# Altium project Cell_121.PrjPcb
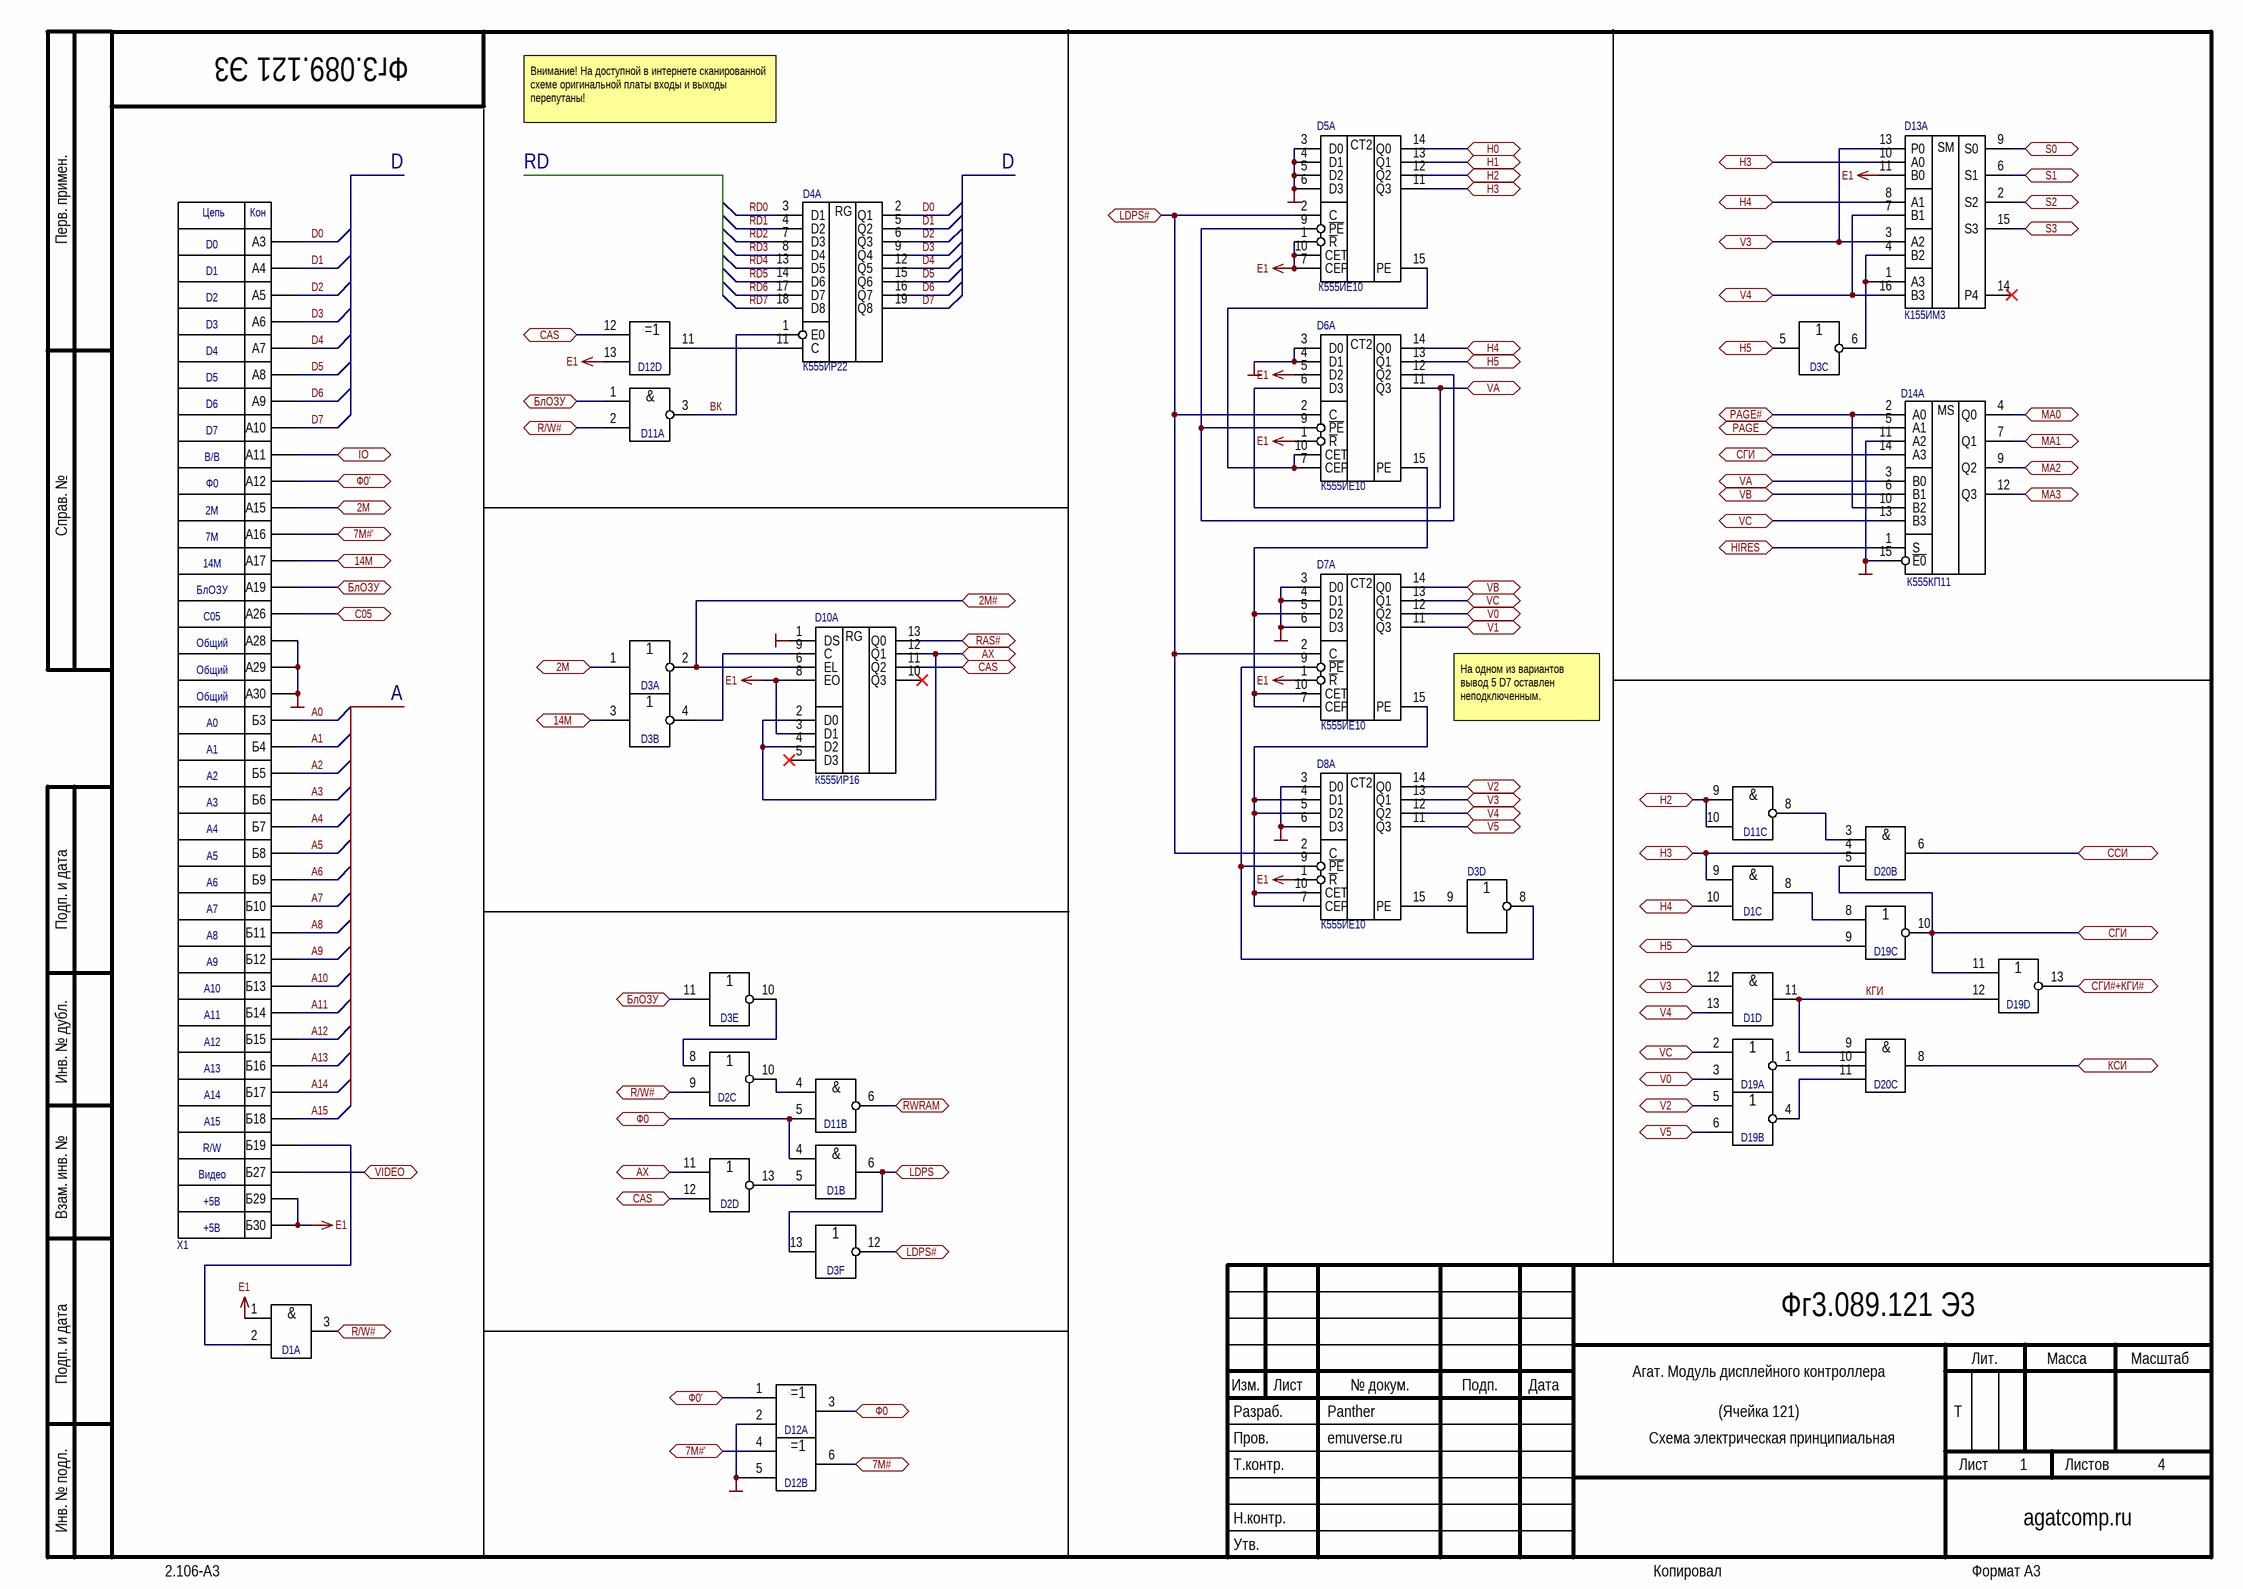
[diagram p0: Cell_121_sheet_1.SchDoc]
4 sheets, 104 parts. Net scope: global (net labels, ports and power ports of the same name join across sheets).
Board file: Cell_121.PcbDoc
Sheets:
  Cell_121_sheet_1.SchDoc
  Cell_121_sheet_2.SchDoc
  Cell_121_sheet_3.SchDoc
  Cell_121_sheet_4.SchDoc

## Sheet Cell_121_sheet_1.SchDoc: Агат. Модуль дисплейного контроллера
size 420 x 297 mm; ApprovedBy: v0.4; CheckedBy: emuverse.ru; Author: Panther; CompanyName: agatcomp.ru; DocumentNumber: Фг3.089.121 Э3; Revision: v0.4; SheetNumber: 1; SheetTotal: 4; DocumentType: Схема электрическая принципиальная; Title2str: (Ячейка 121); Letter1Column: T

### Parts
D1  К555ЛИ1  [201.14]  (value not drawn)  (parts A,B,C,D of 5)
D2  К555ЛЕ1  [201.14]  (value not drawn)  (parts C,D of 5)
D3  К555ЛН1  [201.14]  (value not drawn)  (parts A,B,C,D,E,F of 7)
D4  К555ИР22  [201.20]  (part A of 2)
D5  К555ИЕ10  [201.16]  (part A of 2)
D6  К555ИЕ10  [201.16]  (part A of 2)
D7  К555ИЕ10  [201.16]  (part A of 2)
D8  К555ИЕ10  [201.16]  (part A of 2)
D10  К555ИР16  [201.14]  (part A of 2)
D11  К555ЛА3  [201.14]  (value not drawn)  (parts A,B,C of 5)
D12  К555ЛП5  [201.14]  (value not drawn)  (parts A,B,D of 5)
D13  К155ИМ3  [201.16]  (part A of 2)
D14  К555КП11  [201.16]  (part A of 2)
D19  К555ЛЕ1  [201.14]  (value not drawn)  (parts A,B,C,D of 5)
D20  К555ЛИ3  [201.14]  (value not drawn)  (parts B,C of 4)
X1  Agat-Ext  [AGAT_EXT]  (value not drawn)  (no BOM)

### Ports
2M (bidir, see Cell_121_sheet_1[1B]), 2M# (bidir, see Cell_121_sheet_3[2D]), 7M# (bidir, see Cell_121_sheet_3[1B], Cell_121_sheet_3[1C], Cell_121_sheet_3[2B], Cell_121_sheet_3[3B]), 7M#' (bidir, see Cell_121_sheet_1[1B]), 7M#' (bidir, see Cell_121_sheet_1[2D]), 14M (bidir, see Cell_121_sheet_1[1B]), AX (bidir, see Cell_121_sheet_1[2B], Cell_121_sheet_2[2C]), AX (bidir, see Cell_121_sheet_1[2C], Cell_121_sheet_2[2C]), C05 (bidir, see Cell_121_sheet_3[2D]), CAS (bidir, see Cell_121_sheet_1[1A], Cell_121_sheet_1[2B], Cell_121_sheet_2[3B], Cell_121_sheet_2[3C], Cell_121_sheet_2[3D]), CAS (bidir, see Cell_121_sheet_1[1A], Cell_121_sheet_1[2D], Cell_121_sheet_2[3B], Cell_121_sheet_2[3C], Cell_121_sheet_2[3D]), CAS (bidir, see Cell_121_sheet_1[2B], Cell_121_sheet_1[2D], Cell_121_sheet_2[3B], Cell_121_sheet_2[3C], Cell_121_sheet_2[3D]), H0 (bidir, see Cell_121_sheet_2[2B]), H1 (bidir, see Cell_121_sheet_2[2C]), H2 (bidir, see Cell_121_sheet_1[3A], Cell_121_sheet_2[2B]), H2 (bidir, see Cell_121_sheet_1[3C], Cell_121_sheet_2[2B]), H3 (bidir, see Cell_121_sheet_1[3A], Cell_121_sheet_1[3C]), H3 (bidir, see Cell_121_sheet_1[3A], Cell_121_sheet_1[4A]), H3 (bidir, see Cell_121_sheet_1[3C], Cell_121_sheet_1[4A]), H4 (bidir, see Cell_121_sheet_1[3A], Cell_121_sheet_1[3C]), H4 (bidir, see Cell_121_sheet_1[3A], Cell_121_sheet_1[4A]), H4 (bidir, see Cell_121_sheet_1[3C], Cell_121_sheet_1[4A]), H5 (bidir, see Cell_121_sheet_1[3A], Cell_121_sheet_1[3C]), H5 (bidir, see Cell_121_sheet_1[3A], Cell_121_sheet_1[4A]), H5 (bidir, see Cell_121_sheet_1[3C], Cell_121_sheet_1[4A]), HIRES (bidir, see Cell_121_sheet_3[4D]), IO (bidir, see Cell_121_sheet_2[1D]), LDPS (bidir, see Cell_121_sheet_3[1B], Cell_121_sheet_3[2B], Cell_121_sheet_3[3B]), LDPS# (bidir, see Cell_121_sheet_1[2A]), LDPS# (bidir, see Cell_121_sheet_1[2D]), MA0 (bidir, see Cell_121_sheet_2[2A]), MA1 (bidir, see Cell_121_sheet_2[2B]), MA2 (bidir, see Cell_121_sheet_2[2C]), MA3 (bidir, see Cell_121_sheet_2[2C]), PAGE (bidir, see Cell_121_sheet_3[4C]), PAGE# (bidir, see Cell_121_sheet_3[4C]), R/W# (bidir, see Cell_121_sheet_1[1B], Cell_121_sheet_1[1D], Cell_121_sheet_2[1D]), R/W# (bidir, see Cell_121_sheet_1[1B], Cell_121_sheet_1[2C], Cell_121_sheet_2[1D]), R/W# (bidir, see Cell_121_sheet_1[1D], Cell_121_sheet_1[2C], Cell_121_sheet_2[1D]), RAS# (bidir, see Cell_121_sheet_2[3B], Cell_121_sheet_2[3C], Cell_121_sheet_3[1A], Cell_121_sheet_3[1B]), RWRAM (bidir, see Cell_121_sheet_2[3B], Cell_121_sheet_2[3C], Cell_121_sheet_2[3D]), S0 (bidir, see Cell_121_sheet_2[2C]), S1 (bidir, see Cell_121_sheet_2[2A]), S2 (bidir, see Cell_121_sheet_2[2B]), S3 (bidir, see Cell_121_sheet_2[2C]), V0 (bidir, see Cell_121_sheet_1[3B], Cell_121_sheet_2[2A]), V0 (bidir, see Cell_121_sheet_1[3C], Cell_121_sheet_2[2A]), V1 (bidir, see Cell_121_sheet_2[2B]), V2 (bidir, see Cell_121_sheet_1[3B], Cell_121_sheet_2[2C], Cell_121_sheet_3[4C]), V2 (bidir, see Cell_121_sheet_1[3C], Cell_121_sheet_2[2C], Cell_121_sheet_3[4C]), V3 (bidir, see Cell_121_sheet_1[3C]), V3 (bidir, see Cell_121_sheet_1[3C], Cell_121_sheet_1[4A]), V4 (bidir, see Cell_121_sheet_1[3C], Cell_121_sheet_1[4A], Cell_121_sheet_3[4C]), V4 (bidir, see Cell_121_sheet_1[3C], Cell_121_sheet_3[4C]), V5 (bidir, see Cell_121_sheet_1[3C]), VA (bidir, see Cell_121_sheet_1[3A], Cell_121_sheet_3[2A]), VA (bidir, see Cell_121_sheet_1[4B], Cell_121_sheet_3[2A]), VB (bidir, see Cell_121_sheet_1[3B], Cell_121_sheet_3[2A]), VB (bidir, see Cell_121_sheet_1[4B], Cell_121_sheet_3[2A]), VC (bidir, see Cell_121_sheet_1[3B], Cell_121_sheet_1[3C], Cell_121_sheet_3[2A], Cell_121_sheet_3[3B]), VC (bidir, see Cell_121_sheet_1[3B], Cell_121_sheet_1[4B], Cell_121_sheet_3[2A], Cell_121_sheet_3[3B]), VC (bidir, see Cell_121_sheet_1[3C], Cell_121_sheet_1[4B], Cell_121_sheet_3[2A], Cell_121_sheet_3[3B]), VIDEO (bidir, see Cell_121_sheet_3[4A]), БлОЗУ (bidir, see Cell_121_sheet_1[1B], Cell_121_sheet_1[2C], Cell_121_sheet_2[1C]), БлОЗУ (bidir, see Cell_121_sheet_1[1B], Cell_121_sheet_2[1C]), КСИ (bidir, see Cell_121_sheet_3[4B], Cell_121_sheet_3[4C]), СГИ (bidir, see Cell_121_sheet_1[4B]), СГИ (bidir, see Cell_121_sheet_1[4C]), СГИ#+КГИ# (bidir, see Cell_121_sheet_3[1B]), ССИ (bidir, see Cell_121_sheet_3[4B]), Ф0 (bidir, see Cell_121_sheet_1[2C], Cell_121_sheet_2[2C]), Ф0 (bidir, see Cell_121_sheet_1[2D], Cell_121_sheet_2[2C]), Ф0' (bidir, see Cell_121_sheet_1[1B]), Ф0' (bidir, see Cell_121_sheet_1[2D])

### Nets
E1: D1.1(A) D5.1(~{R}) D5.7(CEP) D5.10(CET) D6.1(~{R}) D6.5(D2) D7.1(~{R}) D8.1(~{R}) D10.3(D1) D10.8(EO) D12.13(A) D13.11(B0) X1.B29(Б29) X1.B30(Б30)
GND: D5.3(D0) D5.4(D1) D5.5(D2) D5.6(D3) D6.3(D0) D6.4(D1) D7.3(D0) D7.4(D1) D7.6(D3) D8.3(D0) D8.6(D3) D10.1(DS) D12.2(B) D12.5(B) D14.11(A2) D14.15(~{E0}) X1.A28 X1.A29 X1.A30
A0: X1.B3(Б3)
A1: X1.B4(Б4)
A2: X1.B5(Б5)
A3: X1.B6(Б6)
A4: X1.B7(Б7)
A5: X1.B8(Б8)
A6: X1.B9(Б9)
A7: X1.B10(Б10)
A8: X1.B11(Б11)
A9: X1.B12(Б12)
A10: X1.B13(Б13)
A11: X1.B14(Б14)
A12: X1.B15(Б15)
A13: X1.B16(Б16)
A14: X1.B17(Б17)
A15: X1.B18(Б18)
D0: D4.2(Q1) X1.A3
D1: D4.5(Q2) X1.A4
D2: D4.6(Q3) X1.A5
D3: D4.9(Q4) X1.A6
D4: D4.12(Q5) X1.A7
D5: D4.15(Q6) X1.A8
D6: D4.16(Q7) X1.A9
D7: D4.19(Q8) X1.A10
RD0: D4.3(D1)
RD1: D4.4(D2)
RD2: D4.7(D3)
RD3: D4.8(D4)
RD4: D4.13(D5)
RD5: D4.14(D6)
RD6: D4.17(D7)
RD7: D4.18(D8)
ВК: D4.1(E0) D11.3(~{O})
КГИ: D1.11(O) D19.12(B) D20.9(A)
NetD1_2: D1.2(B) X1.B19(Б19)
NetD1_3: D1.3(O) D2.9(B) D11.2(B) ; port R/W#
NetD1_4: D1.4(A) D11.5(B) D12.3(O) ; port Ф0
NetD1_5: D1.5(B) D2.13(~{O})
NetD1_6: D1.6(O) D3.13(A) ; port LDPS
NetD1_8: D1.8(O) D19.8(A)
NetD1_9: D1.9(A) D5.11(Q3) D13.10(A0) D20.4(B) ; port H3
NetD1_10: D1.10(B) D6.14(Q0) D13.8(A1) ; port H4
NetD1_12: D1.12(A) D8.13(Q1) D13.3(A2) D13.13(P0) ; port V3
NetD1_13: D1.13(B) D8.12(Q2) D13.7(B1) D13.16(B3) ; port V4
NetD2_3: X1.A11 ; port IO
NetD2_4: D3.11(A) D11.1(A) X1.A19 ; port БлОЗУ
NetD2_8: D2.8(A) D3.10(~{O})
NetD2_10: D2.10(~{O}) D11.4(A)
NetD2_11: D2.11(A) D10.2(D0) D10.4(D2) D10.12(Q1) ; port AX
NetD2_12: D2.12(B) D10.11(Q2) D12.12(B) ; port CAS
NetD3_1: D3.1(A) X1.A15 ; port 2M
NetD3_2: D3.2(~{O}) D10.6(EL) ; port 2M#
NetD3_3: D3.3(A) X1.A17 ; port 14M
NetD3_4: D3.4(~{O}) D10.9(C)
NetD3_5: D3.5(A) D6.13(Q1) D19.9(B) ; port H5
NetD3_6: D3.6(~{O}) D13.1(A3) D13.4(B2)
NetD3_8: D3.8(~{O}) D7.9(~{PE}) D8.9(~{PE})
NetD3_9: D3.9(A) D8.15(PE)
NetD3_12: D3.12(~{O}) D5.2(C) D6.2(C) D7.2(C) D8.2(C) ; port LDPS#
NetD4_11: D4.11(C) D12.11(O)
NetD5_9: D5.9(~{PE}) D6.9(~{PE}) D6.12(Q2)
NetD5_12: D5.12(Q2) D11.9(A) D11.10(B) ; port H2
NetD5_13: D5.13(Q1) ; port H1
NetD5_14: D5.14(Q0) ; port H0
NetD5_15: D5.15(PE) D6.7(CEP) D6.10(CET)
NetD6_6: D6.6(D3) D6.11(Q3) D14.3(B0) ; port VA
NetD6_15: D6.15(PE) D7.5(D2) D7.7(CEP) D7.10(CET)
NetD7_11: D7.11(Q3) ; port V1
NetD7_12: D7.12(Q2) D19.3(B) ; port V0
NetD7_13: D7.13(Q1) D14.13(B3) D19.2(A) ; port VC
NetD7_14: D7.14(Q0) D14.6(B1) ; port VB
NetD7_15: D7.15(PE) D8.4(D1) D8.5(D2) D8.7(CEP) D8.10(CET)
NetD8_11: D8.11(Q3) D19.6(B) ; port V5
NetD8_14: D8.14(Q0) D19.5(A) ; port V2
NetD10_13: D10.13(Q0) ; port RAS#
NetD11_6: D11.6(~{O}) ; port RWRAM
NetD11_8: D11.8(~{O}) D20.3(A)
NetD12_1: D12.1(A) X1.A12 ; port Ф0'
NetD12_4: D12.4(A) X1.A16 ; port 7M#'
NetD12_6: D12.6(O) ; port 7M#
NetD13_2: D13.2(S2) ; port S2
NetD13_6: D13.6(S1) ; port S1
NetD13_9: D13.9(S0) ; port S0
NetD13_15: D13.15(S3) ; port S3
NetD14_1: D14.1(S) ; port HIRES
NetD14_2: D14.2(A0) D14.10(B2) ; port PAGE#
NetD14_4: D14.4(Q0) ; port MA0
NetD14_5: D14.5(A1) ; port PAGE
NetD14_7: D14.7(Q1) ; port MA1
NetD14_9: D14.9(Q2) ; port MA2
NetD14_12: D14.12(Q3) ; port MA3
NetD14_14: D14.14(A3) D19.10(~{O}) D19.11(A) D20.5(C) ; port СГИ
NetD19_1: D19.1(~{O}) D20.10(B)
NetD19_4: D19.4(~{O}) D20.11(C)
NetD19_13: D19.13(~{O}) ; port СГИ#+КГИ#
NetD20_6: D20.6(~{O}) ; port ССИ
NetD20_8: D20.8(~{O}) ; port КСИ
NetD43_4: X1.A26 ; port C05
NetR24_1: X1.B27(Б27) ; port VIDEO

Not connected (* = marked no-connect by the designer): D10 5(D3)* 10(Q3)*; D13 14(P4)*

### Notes on the sheet
- Внимание! На доступной в интернете сканированной схеме оригинальной платы входы и выходы перепутаны!
- D
- RD
- A
- (near D7) На одном из вариантов
  вывод 5 D7 оставлен
  неподключенным.
- Перв. примен.
- Справ. №
- Подп. и дата
- Инв. № дубл.
- Взам. инв. №
- Разраб.
- Изм.
- Лист
- № докум.
- Подп.
- Дата
- Лит.
- Масса
- Масштаб
- Пров.
- Т.контр.
- Листов
- Инв. № подл.
- Утв.
- Н.контр.
- 2.106-A3
- Копировал
- Формат А3
- (in symbol Agat-Ext) Цепь; Кон; D0; D1; D2; D3; D4; D5; D6; D7; В/В; Ф0; 2М; 7М; 14М; БлОЗУ; C05; Общий; A0; A1; A2; A13; A14; R/W; Видео; +5В
- (in symbol К155ИМ3, part A) SM
- (in symbol К555ИЕ10, part A) CT2
- (in symbol К555ИР16, part A) RG
- (in symbol К555ИР22, part A) RG
- (in symbol К555КП11, part A) MS
- (in symbol К555ЛА3, part A) &
- (in symbol К555ЛА3, part B) &
- (in symbol К555ЛА3, part C) &
- (in symbol К555ЛИ1, part A) &
- (in symbol К555ЛИ1, part B) &
- (in symbol К555ЛИ1, part C) &
- (in symbol К555ЛИ1, part D) &
- (in symbol К555ЛИ3, part B) &
- (in symbol К555ЛИ3, part C) &
- (in symbol К555ЛП5, part A) ·=1; ·
- (in symbol К555ЛП5, part B) ·=1; ·
- (in symbol К555ЛП5, part D) ·=1; ·

### Library data of the parts
D2 D19 = К555ЛЕ1: ManufacturerPartNumber: К555ЛА3
D3 = К555ЛН1: ManufacturerPartNumber: К155ЛН1
D5-D8 = К555ИЕ10: ManufacturerPartNumber: КР531ИЕ17
D10 = К555ИР16: ManufacturerPartNumber: КР531ИЕ17
D12 = К555ЛП5: ManufacturerPartNumber: К155ЛП5
D13 = К155ИМ3: ManufacturerPartNumber: SN74ALS138
D20 = К555ЛИ3: ManufacturerPartNumber: К555ЛА3
D1 = К555ЛИ1: ManufacturerPartNumber: К555ЛИ1
D11 = К555ЛА3: ManufacturerPartNumber: К555ЛА3
D14 = К555КП11: ManufacturerPartNumber: К555КП11

## Sheet Cell_121_sheet_2.SchDoc
size 420 x 297 mm; DocumentNumber: Фг3.089.121 Э3; SheetNumber: 2; SheetTotal: 4
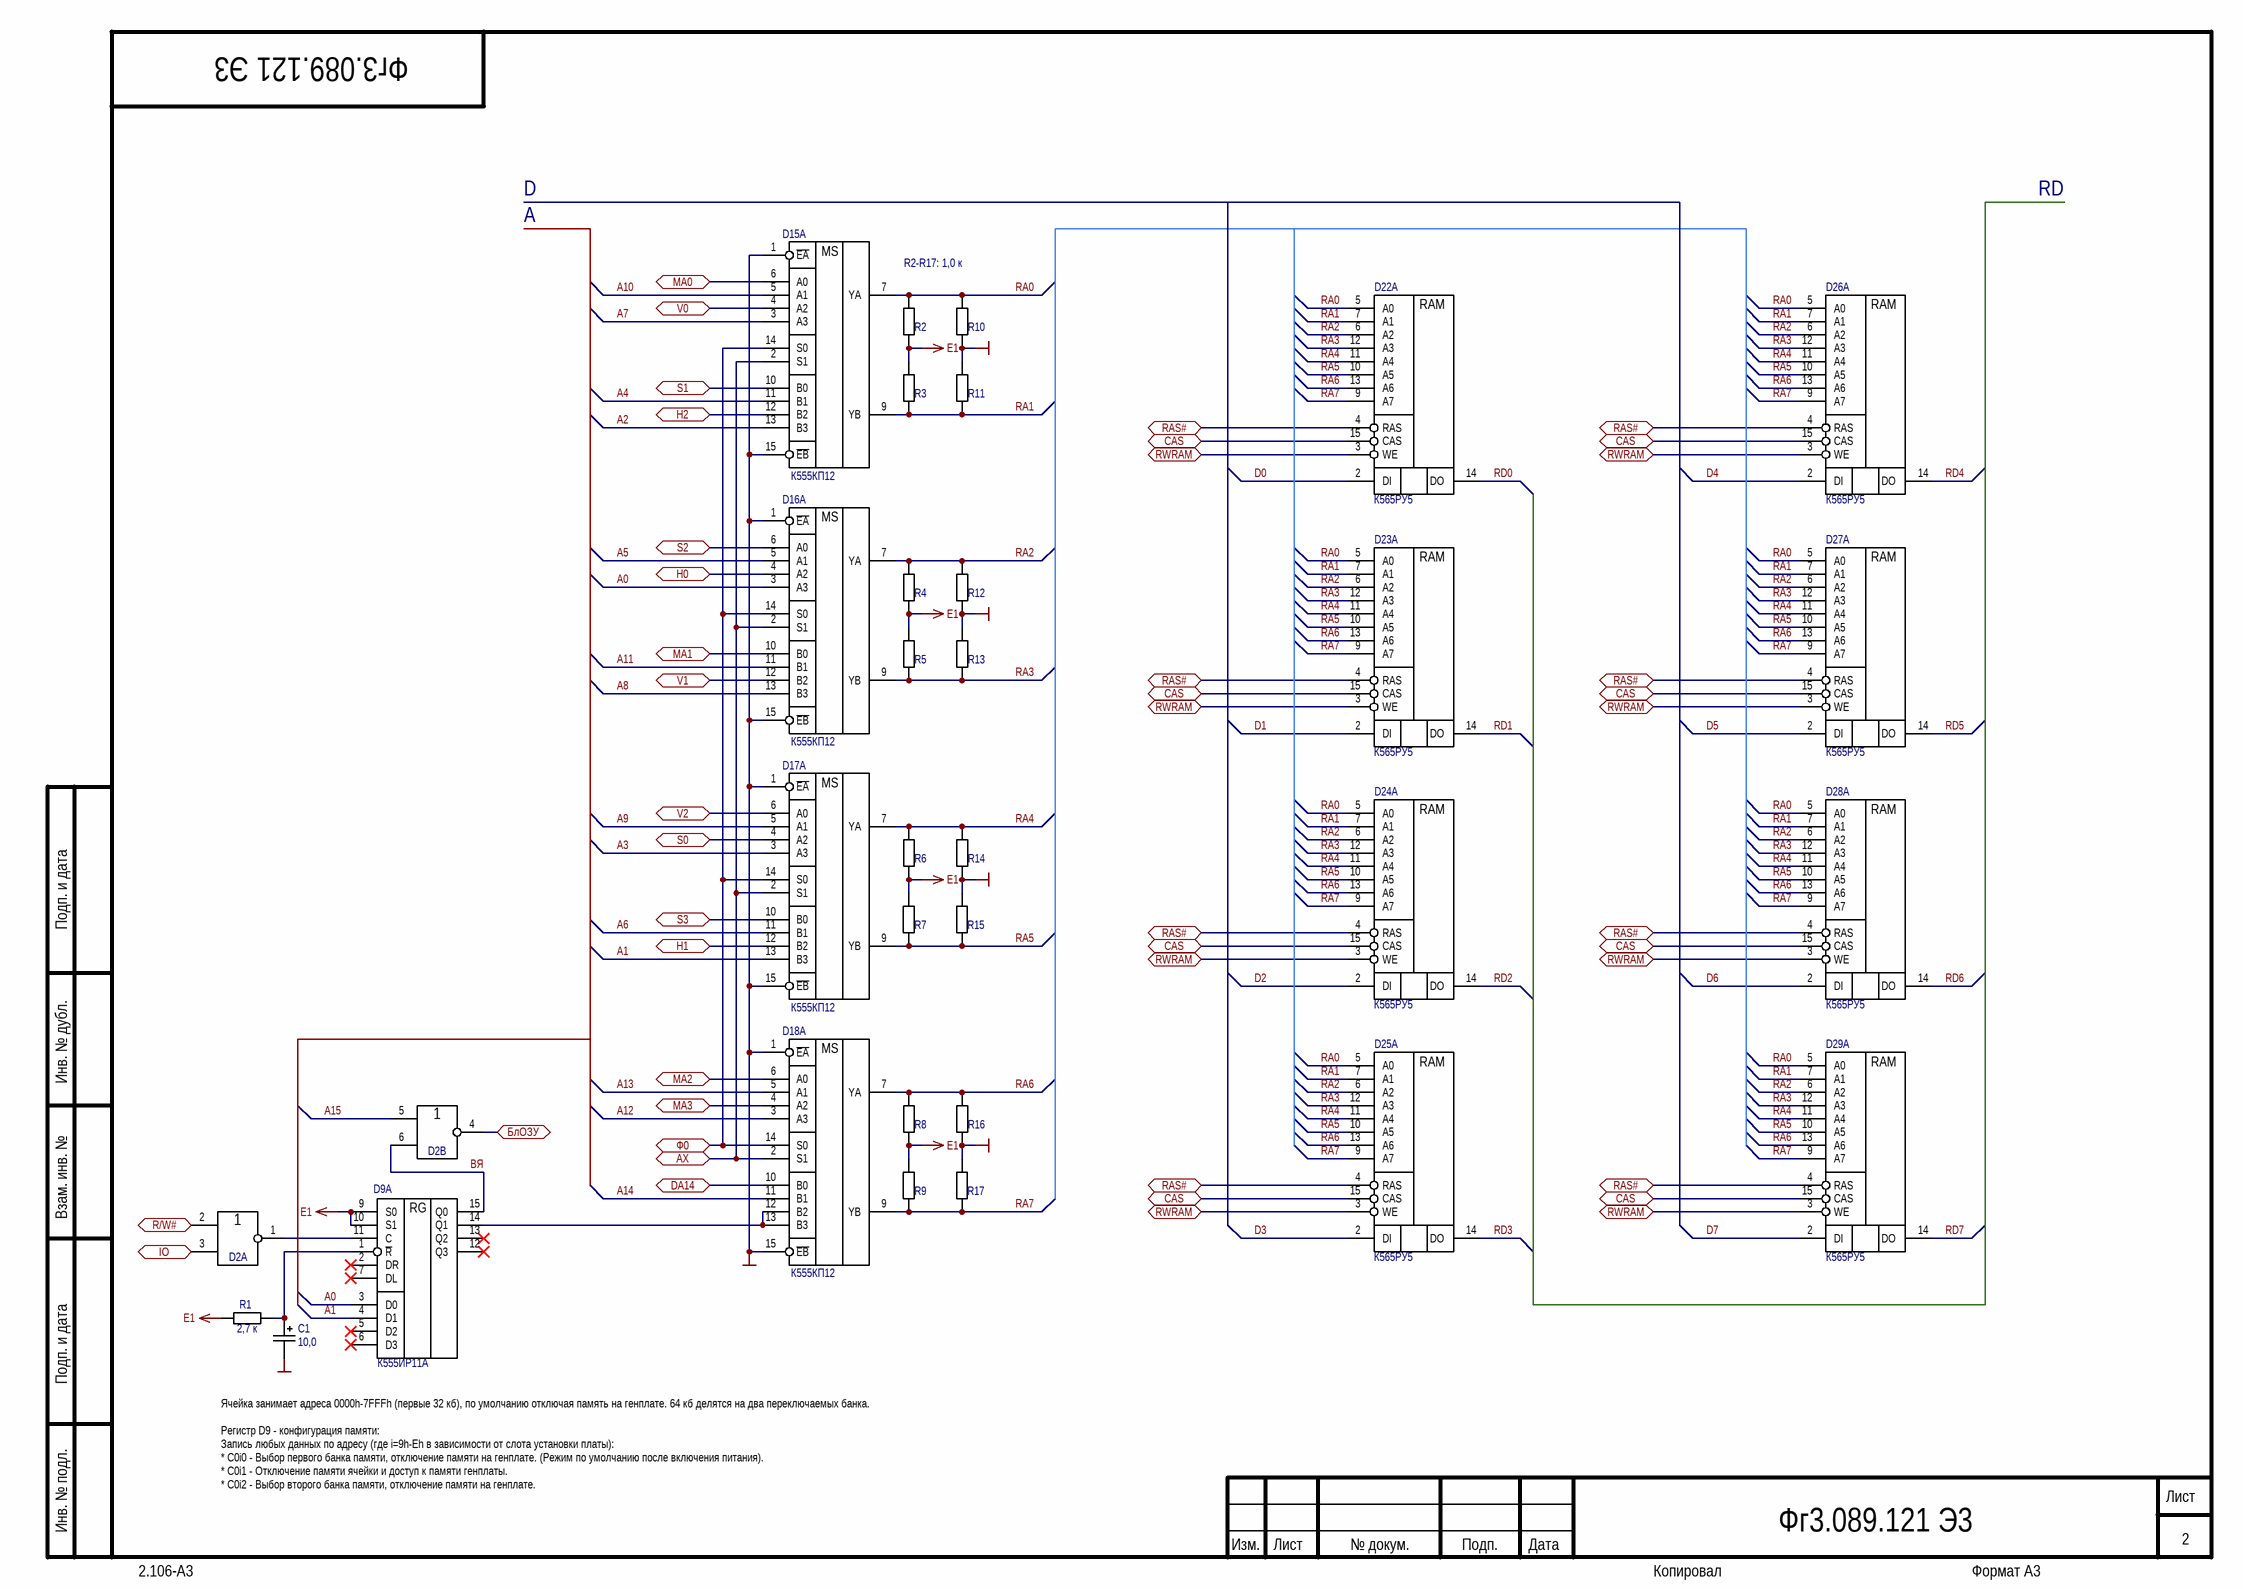
[diagram p1: Cell_121_sheet_2.SchDoc]

### Parts
C1  10,0  [CP25]
D2  К555ЛЕ1  [201.14]  (value not drawn)  (parts A,B of 5)
D9  К555ИР11А  [201.16]  (part A of 2)
D15  К555КП12  [201.16]  (part A of 2)
D16  К555КП12  [201.16]  (part A of 2)
D17  К555КП12  [201.16]  (part A of 2)
D18  К555КП12  [201.16]  (part A of 2)
D22  К565РУ5  [201.16]  (part A of 2)
D23  К565РУ5  [201.16]  (part A of 2)
D24  К565РУ5  [201.16]  (part A of 2)
D25  К565РУ5  [201.16]  (part A of 2)
D26  К565РУ5  [201.16]  (part A of 2)
D27  К565РУ5  [201.16]  (part A of 2)
D28  К565РУ5  [201.16]  (part A of 2)
D29  К565РУ5  [201.16]  (part A of 2)
R1  2,7 к  [R10]
R2  1 к  [R10]  (value not drawn)
R3  1 к  [R10]  (value not drawn)
R4  1 к  [R10]  (value not drawn)
R5  1 к  [R10]  (value not drawn)
R6  1 к  [R10]  (value not drawn)
R7  1 к  [R10]  (value not drawn)
R8  1 к  [R10]  (value not drawn)
R9  1 к  [R10]  (value not drawn)
R10  1 к  [R10]  (value not drawn)
R11  1 к  [R10]  (value not drawn)
R12  1 к  [R10]  (value not drawn)
R13  1 к  [R10]  (value not drawn)
R14  1 к  [R10]  (value not drawn)
R15  1 к  [R10]  (value not drawn)
R16  1 к  [R10]  (value not drawn)
R17  1 к  [R10]  (value not drawn)

### Ports
AX (bidir, see Cell_121_sheet_1[2B], Cell_121_sheet_1[2C]), CAS (bidir, see Cell_121_sheet_1[1A], Cell_121_sheet_1[2B], Cell_121_sheet_1[2D], Cell_121_sheet_2[3B], Cell_121_sheet_2[3C], Cell_121_sheet_2[3D]), DA14 (bidir, see Cell_121_sheet_3[4C]), H0 (bidir, see Cell_121_sheet_1[3A]), H1 (bidir, see Cell_121_sheet_1[3A]), H2 (bidir, see Cell_121_sheet_1[3A], Cell_121_sheet_1[3C]), IO (bidir, see Cell_121_sheet_1[1B]), MA0 (bidir, see Cell_121_sheet_1[4B]), MA1 (bidir, see Cell_121_sheet_1[4B]), MA2 (bidir, see Cell_121_sheet_1[4B]), MA3 (bidir, see Cell_121_sheet_1[4B]), R/W# (bidir, see Cell_121_sheet_1[1B], Cell_121_sheet_1[1D], Cell_121_sheet_1[2C]), RAS# (bidir, see Cell_121_sheet_1[2B], Cell_121_sheet_2[3B], Cell_121_sheet_2[3C], Cell_121_sheet_3[1A], Cell_121_sheet_3[1B]), RWRAM (bidir, see Cell_121_sheet_1[2C], Cell_121_sheet_2[3B], Cell_121_sheet_2[3C], Cell_121_sheet_2[3D]), S0 (bidir, see Cell_121_sheet_1[4A]), S1 (bidir, see Cell_121_sheet_1[4A]), S2 (bidir, see Cell_121_sheet_1[4A]), S3 (bidir, see Cell_121_sheet_1[4A]), V0 (bidir, see Cell_121_sheet_1[3B], Cell_121_sheet_1[3C]), V1 (bidir, see Cell_121_sheet_1[3B]), V2 (bidir, see Cell_121_sheet_1[3B], Cell_121_sheet_1[3C], Cell_121_sheet_3[4C]), БлОЗУ (bidir, see Cell_121_sheet_1[1B], Cell_121_sheet_1[2C]), Ф0 (bidir, see Cell_121_sheet_1[2C], Cell_121_sheet_1[2D])

### Nets
E1: D9.9(S0) D9.10(S1) R1.2 R2.2 R3.1 R4.2 R5.1 R6.2 R7.2 R8.2 R9.2
GND: C1.2 D15.1(~{EA}) D15.15(~{EB}) D16.1(~{EA}) D16.15(~{EB}) D17.1(~{EA}) D17.15(~{EB}) D18.1(~{EA}) D18.15(~{EB}) R10.2 R11.1 R12.2 R13.1 R14.2 R15.2 R16.2 R17.2
A0: D9.3(D0) D16.3(A3)
A1: D9.4(D1) D17.13(B3)
A2: D15.13(B3)
A3: D17.3(A3)
A4: D15.11(B1)
A5: D16.5(A1)
A6: D17.11(B1)
A7: D15.3(A3)
A8: D16.13(B3)
A9: D17.5(A1)
A10: D15.5(A1)
A11: D16.11(B1)
A12: D18.3(A3)
A13: D18.5(A1)
A14: D18.11(B1)
A15: D2.5(A)
D0: D22.2(DI)
D1: D23.2(DI)
D2: D24.2(DI)
D3: D25.2(DI)
D4: D26.2(DI)
D5: D27.2(DI)
D6: D28.2(DI)
D7: D29.2(DI)
RA0: D15.7(YA) D22.5(A0) D23.5(A0) D24.5(A0) D25.5(A0) D26.5(A0) D27.5(A0) D28.5(A0) D29.5(A0) R2.1 R10.1
RA1: D15.9(YB) D22.7(A1) D23.7(A1) D24.7(A1) D25.7(A1) D26.7(A1) D27.7(A1) D28.7(A1) D29.7(A1) R3.2 R11.2
RA2: D16.7(YA) D22.6(A2) D23.6(A2) D24.6(A2) D25.6(A2) D26.6(A2) D27.6(A2) D28.6(A2) D29.6(A2) R4.1 R12.1
RA3: D16.9(YB) D22.12(A3) D23.12(A3) D24.12(A3) D25.12(A3) D26.12(A3) D27.12(A3) D28.12(A3) D29.12(A3) R5.2 R13.2
RA4: D17.7(YA) D22.11(A4) D23.11(A4) D24.11(A4) D25.11(A4) D26.11(A4) D27.11(A4) D28.11(A4) D29.11(A4) R6.1 R14.1
RA5: D17.9(YB) D22.10(A5) D23.10(A5) D24.10(A5) D25.10(A5) D26.10(A5) D27.10(A5) D28.10(A5) D29.10(A5) R7.1 R15.1
RA6: D18.7(YA) D22.13(A6) D23.13(A6) D24.13(A6) D25.13(A6) D26.13(A6) D27.13(A6) D28.13(A6) D29.13(A6) R8.1 R16.1
RA7: D18.9(YB) D22.9(A7) D23.9(A7) D24.9(A7) D25.9(A7) D26.9(A7) D27.9(A7) D28.9(A7) D29.9(A7) R9.1 R17.1
RD0: D22.14(DO)
RD1: D23.14(DO)
RD2: D24.14(DO)
RD3: D25.14(DO)
RD4: D26.14(DO)
RD5: D27.14(DO)
RD6: D28.14(DO)
RD7: D29.14(DO)
ВЯ: D2.6(B) D9.15(Q0)
NetC1_1: C1.1 D9.1(~{R}) R1.1
NetD1_3: D2.2(A) ; port R/W#
NetD1_4: D15.14(S0) D16.14(S0) D17.14(S0) D18.14(S0) ; port Ф0
NetD2_1: D2.1(~{O}) D9.11(C)
NetD2_3: D2.3(B) ; port IO
NetD2_4: D2.4(~{O}) ; port БлОЗУ
NetD2_11: D15.2(S1) D16.2(S1) D17.2(S1) D18.2(S1) ; port AX
NetD2_12: D22.15(CAS) D23.15(CAS) D24.15(CAS) D25.15(CAS) D26.15(CAS) D27.15(CAS) D28.15(CAS) D29.15(CAS) ; port CAS
NetD5_12: D15.12(B2) ; port H2
NetD5_13: D17.12(B2) ; port H1
NetD5_14: D16.4(A2) ; port H0
NetD7_11: D16.12(B2) ; port V1
NetD7_12: D15.4(A2) ; port V0
NetD8_14: D17.6(A0) ; port V2
NetD9_14: D9.14(Q1) D18.12(B2) D18.13(B3)
NetD10_13: D22.4(RAS) D23.4(RAS) D24.4(RAS) D25.4(RAS) D26.4(RAS) D27.4(RAS) D28.4(RAS) D29.4(RAS) ; port RAS#
NetD11_6: D22.3(WE) D23.3(WE) D24.3(WE) D25.3(WE) D26.3(WE) D27.3(WE) D28.3(WE) D29.3(WE) ; port RWRAM
NetD13_2: D16.6(A0) ; port S2
NetD13_6: D15.10(B0) ; port S1
NetD13_9: D17.4(A2) ; port S0
NetD13_15: D17.10(B0) ; port S3
NetD14_4: D15.6(A0) ; port MA0
NetD14_7: D16.10(B0) ; port MA1
NetD14_9: D18.6(A0) ; port MA2
NetD14_12: D18.4(A2) ; port MA3
NetD18_10: D18.10(B0) ; port DA14

Not connected (* = marked no-connect by the designer): D9 2(DR)* 5(D2)* 6(D3)* 7(DL)* 12(Q3)* 13(Q2)*

### Notes on the sheet
- A
- D
- RD
- R2-R17: 1,0 к
- Ячейка занимает адреса 0000h-7FFFh (первые 32 кб), по умолчанию отключая память на генплате. 64 кб делятся на два переключаемых банка.
  Регистр D9 - конфигурация памяти:
  Запись любых данных по адресу (где i=9h-Eh в зависимости от слота установки платы):
  * C0i0 - Выбор первого банка памяти, отключение памяти на генплате. (Режим по умолчанию после включения питания).
  * C0i1 - Отключение памяти ячейки и доступ к памяти генплаты.
  * C0i2 - Выбор второго банка памяти, отключение памяти на генплате.
- Подп. и дата
- Инв. № дубл.
- Взам. инв. №
- Инв. № подл.
- Изм.
- Лист
- № докум.
- Подп.
- Дата
- 2.106-A3
- Копировал
- Формат А3
- (in symbol К555ИР11А, part A) RG
- (in symbol К555КП12, part A) MS
- (in symbol К565РУ5, part A) RAM

### Library data of the parts
C1 = К53-14: Value: 10,0
D2 = К555ЛЕ1: ManufacturerPartNumber: К555ЛА3
D9 = К555ИР11А: ManufacturerPartNumber: КР531ИЕ17
D15-D18 = К555КП12: ManufacturerPartNumber: К155КП2
R1-R17 = С2-23: Резистор
  R1: Value: 2,7 к
  R2-R17: Value: 1 к
D22-D29 = К565РУ5: ManufacturerPartNumber: К565РУ5

## Sheet Cell_121_sheet_3.SchDoc
size 420 x 297 mm; DocumentNumber: Фг3.089.121 Э3; SheetNumber: 3; SheetTotal: 4
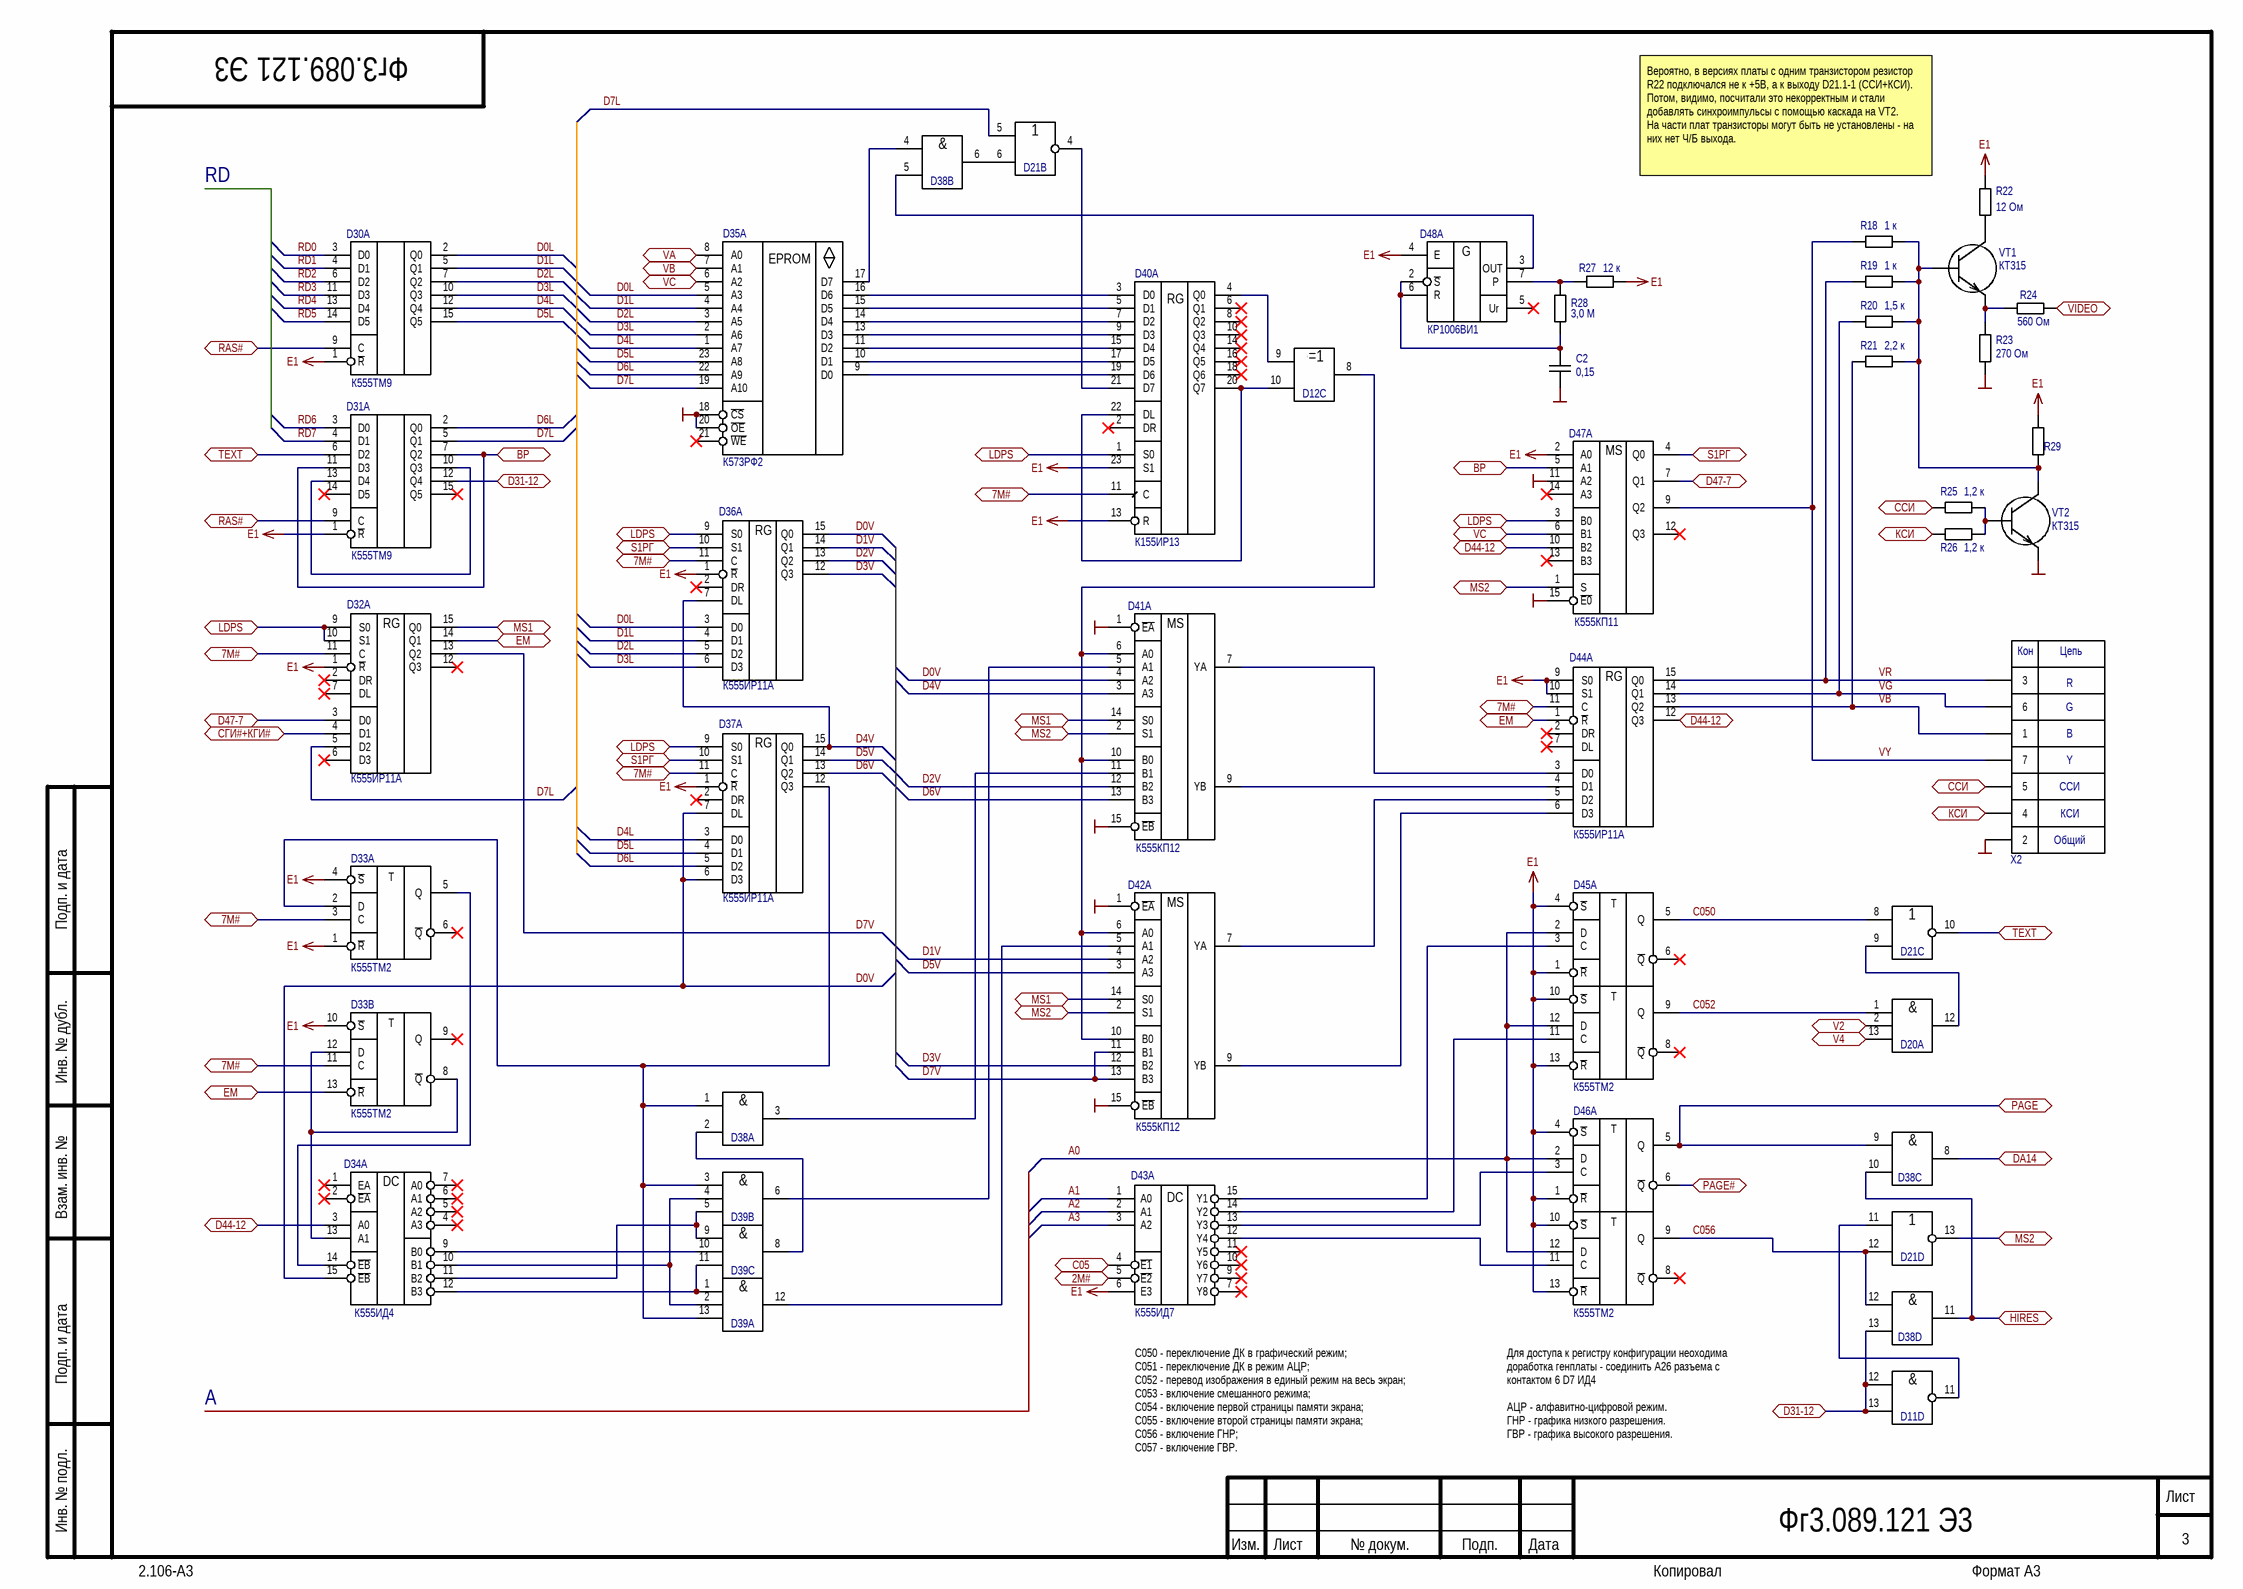
[diagram p2: Cell_121_sheet_3.SchDoc]

### Parts
C2  0,15  [C5]
D11  К555ЛА3  [201.14]  (value not drawn)  (part D of 5)
D12  К555ЛП5  [201.14]  (value not drawn)  (part C of 5)
D20  К555ЛИ3  [201.14]  (value not drawn)  (part A of 4)
D21  К555ЛЕ1  [201.14]  (value not drawn)  (parts B,C,D of 5)
D30  К555ТМ9  [201.16]  (part A of 2)
D31  К555ТМ9  [201.16]  (part A of 2)
D32  К555ИР11А  [201.16]  (part A of 2)
D33  К555ТМ2  [201.14]  (parts A,B of 3)
D34  К555ИД4  [201.16]  (part A of 2)
D35  К573РФ2  [2120.24 socket]  (part A of 2)
D36  К555ИР11А  [201.16]  (part A of 2)
D37  К555ИР11А  [201.16]  (part A of 2)
D38  К555ЛИ1  [201.14]  (value not drawn)  (parts A,B,C,D of 5)
D39  К555ЛИ3  [201.14]  (value not drawn)  (parts A,B,C of 4)
D40  К155ИР13  [2120.24]  (part A of 2)
D41  К555КП12  [201.16]  (part A of 2)
D42  К555КП12  [201.16]  (part A of 2)
D43  К555ИД7  [201.16]  (part A of 2)
D44  К555ИР11А  [201.16]  (part A of 2)
D45  К555ТМ2  [201.14]  (value not drawn)  (parts A,B of 3)
D46  К555ТМ2  [201.14]  (value not drawn)  (parts A,B of 3)
D47  К555КП11  [201.16]  (part A of 2)
D48  КР1006ВИ1  [2101.8]  (part A of 2)
R18  1 к  [R10]
R19  1 к  [R10]
R20  1,5 к  [R10]
R21  2,2 к  [R10]
R22  12 Ом  [R10]
R23  270 Ом  [R10]
R24  560 Ом  [R10]
R25  1,2 к  [R10]
R26  1,2 к  [R10]
R27  12 к  [R10]
R28  3,0 М  [R10]
R29  ???  [R10]  (value not drawn)
VT1  КТ315  [КТ315]
VT2  КТ315  [КТ315]
X2  RGB121  [RGB_VIDEO]  (value not drawn)  (no BOM)

### Ports
2M# (bidir, see Cell_121_sheet_1[2B]), 7M# (bidir, see Cell_121_sheet_1[2D], Cell_121_sheet_3[1B], Cell_121_sheet_3[1C], Cell_121_sheet_3[2B]), 7M# (bidir, see Cell_121_sheet_1[2D], Cell_121_sheet_3[1B], Cell_121_sheet_3[1C], Cell_121_sheet_3[2B], Cell_121_sheet_3[3B]), 7M# (bidir, see Cell_121_sheet_1[2D], Cell_121_sheet_3[1C], Cell_121_sheet_3[2B], Cell_121_sheet_3[3B]), BP (bidir, see Cell_121_sheet_3[1B]), BP (bidir, see Cell_121_sheet_3[3B]), C05 (bidir, see Cell_121_sheet_1[1B]), D31-12 (bidir, see Cell_121_sheet_3[1B]), D31-12 (bidir, see Cell_121_sheet_3[4D]), D44-12 (bidir, see Cell_121_sheet_3[1D], Cell_121_sheet_3[3B]), D44-12 (bidir, see Cell_121_sheet_3[1D], Cell_121_sheet_3[4B]), D44-12 (bidir, see Cell_121_sheet_3[3B], Cell_121_sheet_3[4B]), D47-7 (bidir, see Cell_121_sheet_3[1B]), D47-7 (bidir, see Cell_121_sheet_3[4B]), DA14 (bidir, see Cell_121_sheet_2[2C]), EM (bidir, see Cell_121_sheet_3[1B], Cell_121_sheet_3[1C]), EM (bidir, see Cell_121_sheet_3[1B], Cell_121_sheet_3[3B]), EM (bidir, see Cell_121_sheet_3[1C], Cell_121_sheet_3[3B]), HIRES (bidir, see Cell_121_sheet_1[4B]), LDPS (bidir, see Cell_121_sheet_1[2C], Cell_121_sheet_3[1B], Cell_121_sheet_3[2B]), LDPS (bidir, see Cell_121_sheet_1[2C], Cell_121_sheet_3[1B], Cell_121_sheet_3[2B], Cell_121_sheet_3[3B]), LDPS (bidir, see Cell_121_sheet_1[2C], Cell_121_sheet_3[2B], Cell_121_sheet_3[3B]), MS1 (bidir, see Cell_121_sheet_3[1B], Cell_121_sheet_3[2B]), MS1 (bidir, see Cell_121_sheet_3[1B], Cell_121_sheet_3[2C]), MS1 (bidir, see Cell_121_sheet_3[2B], Cell_121_sheet_3[2C]), MS2 (bidir, see Cell_121_sheet_3[2B], Cell_121_sheet_3[2C], Cell_121_sheet_3[3B]), MS2 (bidir, see Cell_121_sheet_3[2B], Cell_121_sheet_3[2C], Cell_121_sheet_3[4D]), MS2 (bidir, see Cell_121_sheet_3[2B], Cell_121_sheet_3[3B], Cell_121_sheet_3[4D]), MS2 (bidir, see Cell_121_sheet_3[2C], Cell_121_sheet_3[3B], Cell_121_sheet_3[4D]), PAGE (bidir, see Cell_121_sheet_1[4B]), PAGE# (bidir, see Cell_121_sheet_1[4B]), RAS# (bidir, see Cell_121_sheet_1[2B], Cell_121_sheet_2[3B], Cell_121_sheet_2[3C], Cell_121_sheet_3[1A]), RAS# (bidir, see Cell_121_sheet_1[2B], Cell_121_sheet_2[3B], Cell_121_sheet_2[3C], Cell_121_sheet_3[1B]), S1РГ (bidir, see Cell_121_sheet_3[2B]), S1РГ (bidir, see Cell_121_sheet_3[2B], Cell_121_sheet_3[4B]), TEXT (bidir, see Cell_121_sheet_3[1B]), TEXT (bidir, see Cell_121_sheet_3[4C]), V2 (bidir, see Cell_121_sheet_1[3B], Cell_121_sheet_1[3C], Cell_121_sheet_2[2C]), V4 (bidir, see Cell_121_sheet_1[3C], Cell_121_sheet_1[4A]), VA (bidir, see Cell_121_sheet_1[3A], Cell_121_sheet_1[4B]), VB (bidir, see Cell_121_sheet_1[3B], Cell_121_sheet_1[4B]), VC (bidir, see Cell_121_sheet_1[3B], Cell_121_sheet_1[3C], Cell_121_sheet_1[4B], Cell_121_sheet_3[2A]), VC (bidir, see Cell_121_sheet_1[3B], Cell_121_sheet_1[3C], Cell_121_sheet_1[4B], Cell_121_sheet_3[3B]), VIDEO (bidir, see Cell_121_sheet_1[1C]), КСИ (bidir, see Cell_121_sheet_1[4C], Cell_121_sheet_3[4B]), КСИ (bidir, see Cell_121_sheet_1[4C], Cell_121_sheet_3[4C]), СГИ#+КГИ# (bidir, see Cell_121_sheet_1[4C]), ССИ (bidir, see Cell_121_sheet_1[4C], Cell_121_sheet_3[4B])

### Nets
E1: D30.1(~{R}) D31.1(~{R}) D32.1(~{R}) D33.1(~{R}) D33.4(~{S}) D33.10(~{S}) D36.1(~{R}) D37.1(~{R}) D40.13(R) D40.23(S1) D43.6(E3) D44.9(S0) D44.10(S1) D45.1(~{R}) D45.4(~{S}) D45.10(~{S}) D45.13(~{R}) D46.1(~{R}) D46.4(~{S}) D46.10(~{S}) D46.13(~{R}) D47.2(A0) D48.4(E) R22.2 R27.2 R29.2
GND: C2.2 D35.18(~{CS}) D35.20(~{OE}) D41.1(~{EA}) D41.15(~{EB}) D42.1(~{EA}) D42.15(~{EB}) D47.11(A2) D47.15(~{E0}) R23.1 VT2.E X2.2
A0: D45.2(D) D45.12(D) D46.2(D) D46.12(D)
A1: D43.1(A0)
A2: D43.2(A1)
A3: D43.3(A2)
C050: D21.8(A) D45.5(Q)
C052: D20.1(A) D45.9(Q)
C056: D21.12(B) D38.12(A) D46.9(Q)
D0L: D30.2(Q0) D35.5(A3) D36.3(D0)
D0V: D34.15(~{EB}) D36.15(Q0) D37.6(D3) D37.7(DL) D41.4(A2)
D1L: D30.5(Q1) D35.4(A4) D36.4(D1)
D1V: D36.14(Q1) D42.4(A2)
D2L: D30.7(Q2) D35.3(A5) D36.5(D2)
D2V: D36.13(Q2) D41.12(B2)
D3L: D30.10(Q3) D35.2(A6) D36.6(D3)
D3V: D36.12(Q3) D42.12(B2)
D4L: D30.12(Q4) D35.1(A7) D37.3(D0)
D4V: D36.7(DL) D37.15(Q0) D41.3(A3)
D5L: D30.15(Q5) D35.23(A8) D37.4(D1)
D5V: D37.14(Q1) D42.3(A3)
D6L: D31.2(Q0) D35.22(A9) D37.5(D2)
D6V: D37.13(Q2) D41.13(B3)
D7L: D21.5(A) D31.5(Q1) D32.5(D2) D35.19(A10)
D7V: D32.13(Q2) D42.11(B1) D42.13(B3)
RD0: D30.3(D0)
RD1: D30.4(D1)
RD2: D30.6(D2)
RD3: D30.11(D3)
RD4: D30.13(D4)
RD5: D30.14(D5)
RD6: D31.3(D0)
RD7: D31.4(D1)
VB: D44.13(Q2) R21.1 X2.1
VG: D44.14(Q1) R20.2 X2.6
VR: D44.15(Q0) R19.2 X2.3
VY: D47.9(Q2) R18.1 X2.7
NetC2_1: C2.1 D48.2(~{S}) D48.6(R) R28.2
NetD1_6: D32.9(S0) D32.10(S1) D36.9(S0) D37.9(S0) D40.1(S0) D47.3(B0) ; port LDPS
NetD1_13: D20.13(C) ; port V4
NetD3_2: D43.5(~{E2}) ; port 2M#
NetD6_6: D35.8(A0) ; port VA
NetD7_13: D35.6(A2) D47.6(B1) ; port VC
NetD7_14: D35.7(A1) ; port VB
NetD8_14: D20.2(B) ; port V2
NetD10_13: D30.9(C) D31.9(C) ; port RAS#
NetD11_11: D11.11(~{O}) D21.11(A)
NetD11_12: D11.12(A) D11.13(B) D31.12(Q4) D38.13(B) ; port D31-12
NetD12_6: D32.11(C) D33.3(C) D33.11(C) D36.11(C) D37.11(C) D40.11(C) D44.11(C) ; port 7M#
NetD12_8: D12.8(O) D41.6(A0) D41.10(B0) D42.6(A0) D42.10(B0)
NetD12_9: D12.9(B) D40.4(Q0)
NetD12_10: D12.10(A) D40.20(Q7) D40.22(DL)
NetD14_1: D38.10(B) D38.11(O) ; port HIRES
NetD14_2: D46.6(~{Q}) ; port PAGE#
NetD14_5: D38.9(A) D46.5(Q) ; port PAGE
NetD18_10: D38.8(O) ; port DA14
NetD19_13: D32.4(D1) ; port СГИ#+КГИ#
NetD20_6: R25.1 X2.5 ; port ССИ
NetD20_8: R26.1 X2.4 ; port КСИ
NetD20_12: D20.12(~{O}) D21.9(B)
NetD21_4: D21.4(~{O}) D40.21(D7)
NetD21_6: D21.6(B) D38.6(O)
NetD21_10: D21.10(~{O}) D31.6(D2) ; port TEXT
NetD21_13: D21.13(~{O}) D41.2(S1) D42.2(S1) D47.1(S) ; port MS2
NetD31_7: D31.7(Q2) D31.11(D3) D47.5(A1) ; port BP
NetD31_10: D31.10(Q3) D31.13(D4)
NetD32_3: D32.3(D0) D47.7(Q1) ; port D47-7
NetD32_14: D32.14(Q1) D33.13(~{R}) D44.1(~{R}) ; port EM
NetD32_15: D32.15(Q0) D41.14(S0) D42.14(S0) ; port MS1
NetD33_2: D33.2(D) D37.12(Q3) D38.1(A) D39.3(A) D39.13(C)
NetD33_5: D33.5(Q) D34.14(~{EB})
NetD33_8: D33.8(~{Q}) D33.12(D) D34.13(A1)
NetD34_3: D34.3(A0) D44.12(Q3) D47.10(B2) ; port D44-12
NetD34_9: D34.9(B0) D39.10(B)
NetD34_10: D34.10(B1) D39.2(B) D39.4(B)
NetD34_11: D34.11(B2) D39.5(C) D39.9(A)
NetD34_12: D34.12(B3) D39.1(A) D39.11(C)
NetD35_9: D35.9(D0) D40.19(D6)
NetD35_10: D35.10(D1) D40.17(D5)
NetD35_11: D35.11(D2) D40.15(D4)
NetD35_13: D35.13(D3) D40.9(D3)
NetD35_14: D35.14(D4) D40.7(D2)
NetD35_15: D35.15(D5) D40.5(D1)
NetD35_16: D35.16(D6) D40.3(D0)
NetD35_17: D35.17(D7) D38.4(A)
NetD36_10: D36.10(S1) D37.10(S1) D47.4(Q0) ; port S1РГ
NetD38_2: D38.2(B) D39.8(~{O})
NetD38_3: D38.3(O) D41.11(B1)
NetD38_5: D38.5(B) D48.3(OUT)
NetD39_6: D39.6(~{O}) D41.5(A1)
NetD39_12: D39.12(~{O}) D42.5(A1)
NetD41_7: D41.7(YA) D44.3(D0)
NetD41_9: D41.9(YB) D44.4(D1)
NetD42_7: D42.7(YA) D44.5(D2)
NetD42_9: D42.9(YB) D44.6(D3)
NetD43_4: D43.4(~{E1}) ; port C05
NetD43_12: D43.12(Y4) D46.11(C)
NetD43_13: D43.13(Y3) D46.3(C)
NetD43_14: D43.14(Y2) D45.11(C)
NetD43_15: D43.15(Y1) D45.3(C)
NetD48_7: D48.7(P) R27.1 R28.1
NetR18_2: R18.2 R19.1 R20.1 R21.2 R29.1 VT1.B VT2.C
NetR22_1: R22.1 VT1.C
NetR23_2: R23.2 R24.2 VT1.E
NetR24_1: R24.1 ; port VIDEO
NetR25_2: R25.2 R26.2 VT2.B

Not connected (* = marked no-connect by the designer): D31 14(D5)* 15(Q5)*; D32 2(DR)* 6(D3)* 7(DL)* 12(Q3)*; D33 6(~{Q})* 9(Q)*; D34 1(EA)* 2(~{EA})* 4(A3)* 5(A2)* 6(A1)* 7(A0)*; D35 21(~{WE})*; D36 2(DR)*; D37 2(DR)*; D40 2(DR)* 6(Q1)* 8(Q2)* 10(Q3)* 14(Q4)* 16(Q5)* 18(Q6)*; D43 7(Y8)* 9(Y7)* 10(Y6)* 11(Y5)*; D44 2(DR)* 7(DL)*; D45 6(~{Q})* 8(~{Q})*; D46 8(~{Q})*; D47 12(Q3)* 13(B3)* 14(A3)*; D48 5(Ur)*

### Notes on the sheet
- RD
- Вероятно, в версиях платы с одним транзистором резистор R22 подключался не к +5В, а к выходу D21.1-1 (ССИ+КСИ).
  Потом, видимо, посчитали это некорректным и стали добавлять синхроимпульсы с помощью каскада на VT2.
  На части плат транзисторы могут быть не установлены - на них нет Ч/Б выхода.
- A
- (near D43) C050 - переключение ДК в графический режим;
  C051 - переключение ДК в режим АЦР;
  C052 - перевод изображения в единый режим на весь экран;
  C053 - включение смешанного режима;
  C054 - включение первой страницы памяти экрана;
  C055 - включение второй страницы памяти экрана;
  C056 - включение ГНР;
  C057 - включение ГВР.
- (near D46) Для доступа к регистру конфигурации неоходима доработка генплаты - соединить А26 разъема с контактом 6 D7 ИД4
  АЦР - алфавитно-цифровой режим.
  ГНР - графика низкого разрешения.
  ГВР - графика высокого разрешения.
- Подп. и дата
- Инв. № дубл.
- Взам. инв. №
- Инв. № подл.
- Изм.
- Лист
- № докум.
- Подп.
- Дата
- 2.106-A3
- Копировал
- Формат А3
- (in symbol RGB121) Кон; Цепь; R; G; B; Y; ССИ; КСИ; Общий
- (in symbol К155ИР13, part A) RG
- (in symbol К555ИД4, part A) DC
- (in symbol К555ИД7, part A) DC
- (in symbol К555ИР11А, part A) RG
- (in symbol К555КП11, part A) MS
- (in symbol К555КП12, part A) MS
- (in symbol К555ЛА3, part D) &
- (in symbol К555ЛИ1, part A) &
- (in symbol К555ЛИ1, part B) &
- (in symbol К555ЛИ1, part C) &
- (in symbol К555ЛИ1, part D) &
- (in symbol К555ЛИ3, part A) &
- (in symbol К555ЛИ3, part B) &
- (in symbol К555ЛИ3, part C) &
- (in symbol К555ЛП5, part C) ·=1; ·
- (in symbol К555ТМ2, part A) T
- (in symbol К555ТМ2, part B) T
- (in symbol К573РФ2, part A) EPROM
- (in symbol КР1006ВИ1, part A) G

### Library data of the parts
C2 = К10-17: Value: 0,15
D12 = К555ЛП5: ManufacturerPartNumber: К155ЛП5
D20 D39 = К555ЛИ3: ManufacturerPartNumber: К555ЛА3
D21 = К555ЛЕ1: ManufacturerPartNumber: К555ЛА3
D30 D31 = К555ТМ9: ManufacturerPartNumber: SN74ALS174
D32 D36 D37 D44 = К555ИР11А: ManufacturerPartNumber: КР531ИЕ17
D41 D42 = К555КП12: ManufacturerPartNumber: К155КП2
D43 = К555ИД7: ManufacturerPartNumber: SN74ALS138
D48 = КР1006ВИ1: ManufacturerPartNumber: К555ИД4
R18-R29 = С2-23: Резистор
  R18 R19: Value: 1 к
  R20: Value: 1,5 к
  R21: Value: 2,2 к
  R22: Value: 12 Ом
  R23: Value: 270 Ом
  R24: Value: 560 Ом
  R25 R26: Value: 1,2 к
  R27: Value: 12 к
  R28: Value: 3,0 М
  R29: Value: ???
D11 = К555ЛА3: ManufacturerPartNumber: К555ЛА3
D34 = К555ИД4: ManufacturerPartNumber: К555ИД4
D38 = К555ЛИ1: ManufacturerPartNumber: К555ЛИ1
D47 = К555КП11: ManufacturerPartNumber: К555КП11

## Sheet Cell_121_sheet_4.SchDoc
size 209 x 297 mm; DocumentNumber: Фг3.089.121 Э3; SheetNumber: 4; SheetTotal: 4
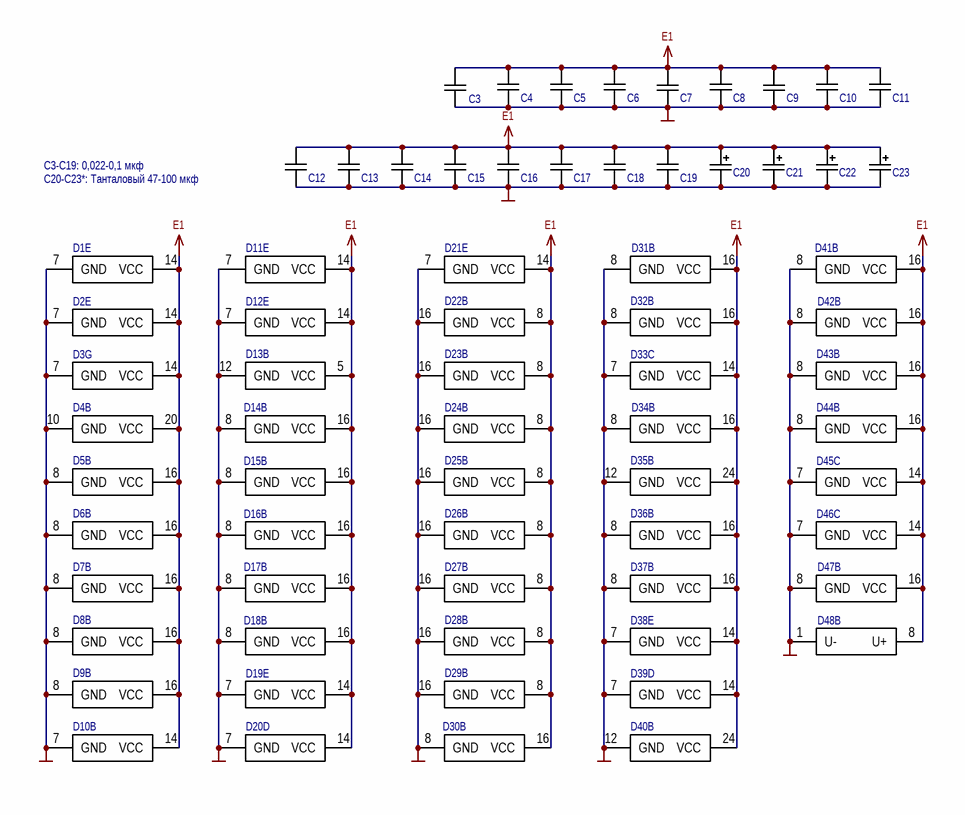
[diagram p3: Cell_121_sheet_4.SchDoc]

### Parts
C3  0,1 мкф  [C5]  (value not drawn)
C4  0,1 мкф  [C5]  (value not drawn)
C5  0,1 мкф  [C5]  (value not drawn)
C6  0,1 мкф  [C5]  (value not drawn)
C7  0,1 мкф  [C5]  (value not drawn)
C8  0,1 мкф  [C5]  (value not drawn)
C9  0,1 мкф  [C5]  (value not drawn)
C10  0,1 мкф  [C5]  (value not drawn)
C11  0,1 мкф  [C5]  (value not drawn)
C12  0,1 мкф  [C5]  (value not drawn)
C13  0,1 мкф  [C5]  (value not drawn)
C14  0,1 мкф  [C5]  (value not drawn)
C15  0,1 мкф  [C5]  (value not drawn)
C16  0,1 мкф  [C5]  (value not drawn)
C17  0,1 мкф  [C5]  (value not drawn)
C18  0,1 мкф  [C5]  (value not drawn)
C19  0,1 мкф  [C5]  (value not drawn)
C20  47 мкф  [SMD D]  (value not drawn)
C21  47 мкф  [SMD D]  (value not drawn)
C22  47 мкф  [SMD D]  (value not drawn)
C23  47 мкф  [SMD D]  (value not drawn)
D1  К555ЛИ1  [201.14]  (value not drawn)  (part E of 5)
D2  К555ЛЕ1  [201.14]  (value not drawn)  (part E of 5)
D3  К555ЛН1  [201.14]  (value not drawn)  (part G of 7)
D4  К555ИР22  [201.20]  (value not drawn)  (part B of 2)
D5  К555ИЕ10  [201.16]  (value not drawn)  (part B of 2)
D6  К555ИЕ10  [201.16]  (value not drawn)  (part B of 2)
D7  К555ИЕ10  [201.16]  (value not drawn)  (part B of 2)
D8  К555ИЕ10  [201.16]  (value not drawn)  (part B of 2)
D9  К555ИР11А  [201.16]  (value not drawn)  (part B of 2)
D10  К555ИР16  [201.14]  (value not drawn)  (part B of 2)
D11  К555ЛА3  [201.14]  (value not drawn)  (part E of 5)
D12  К555ЛП5  [201.14]  (value not drawn)  (part E of 5)
D13  К155ИМ3  [201.16]  (value not drawn)  (part B of 2)
D14  К555КП11  [201.16]  (value not drawn)  (part B of 2)
D15  К555КП12  [201.16]  (value not drawn)  (part B of 2)
D16  К555КП12  [201.16]  (value not drawn)  (part B of 2)
D17  К555КП12  [201.16]  (value not drawn)  (part B of 2)
D18  К555КП12  [201.16]  (value not drawn)  (part B of 2)
D19  К555ЛЕ1  [201.14]  (value not drawn)  (part E of 5)
D20  К555ЛИ3  [201.14]  (value not drawn)  (part D of 4)
D21  К555ЛЕ1  [201.14]  (value not drawn)  (part E of 5)
D22  К565РУ5  [201.16]  (value not drawn)  (part B of 2)
D23  К565РУ5  [201.16]  (value not drawn)  (part B of 2)
D24  К565РУ5  [201.16]  (value not drawn)  (part B of 2)
D25  К565РУ5  [201.16]  (value not drawn)  (part B of 2)
D26  К565РУ5  [201.16]  (value not drawn)  (part B of 2)
D27  К565РУ5  [201.16]  (value not drawn)  (part B of 2)
D28  К565РУ5  [201.16]  (value not drawn)  (part B of 2)
D29  К565РУ5  [201.16]  (value not drawn)  (part B of 2)
D30  К555ТМ9  [201.16]  (value not drawn)  (part B of 2)
D31  К555ТМ9  [201.16]  (value not drawn)  (part B of 2)
D32  К555ИР11А  [201.16]  (value not drawn)  (part B of 2)
D33  К555ТМ2  [201.14]  (value not drawn)  (part C of 3)
D34  К555ИД4  [201.16]  (value not drawn)  (part B of 2)
D35  К573РФ2  [2120.24 socket]  (value not drawn)  (part B of 2)
D36  К555ИР11А  [201.16]  (value not drawn)  (part B of 2)
D37  К555ИР11А  [201.16]  (value not drawn)  (part B of 2)
D38  К555ЛИ1  [201.14]  (value not drawn)  (part E of 5)
D39  К555ЛИ3  [201.14]  (value not drawn)  (part D of 4)
D40  К155ИР13  [2120.24]  (value not drawn)  (part B of 2)
D41  К555КП12  [201.16]  (value not drawn)  (part B of 2)
D42  К555КП12  [201.16]  (value not drawn)  (part B of 2)
D43  К555ИД7  [201.16]  (value not drawn)  (part B of 2)
D44  К555ИР11А  [201.16]  (value not drawn)  (part B of 2)
D45  К555ТМ2  [201.14]  (value not drawn)  (part C of 3)
D46  К555ТМ2  [201.14]  (value not drawn)  (part C of 3)
D47  К555КП11  [201.16]  (value not drawn)  (part B of 2)
D48  КР1006ВИ1  [2101.8]  (value not drawn)  (part B of 2)

### Nets
E1: C3.1 C4.2 C5.2 C6.2 C7.1 C8.2 C9.1 C10.2 C11.2 C12.2 C13.2 C14.2 C15.2 C16.2 C17.2 C18.2 C19.2 C20.1 C21.1 C22.1 C23.1 D1.14(VCC) D2.14(VCC) D3.14(VCC) D4.20(VCC) D5.16(VCC) D6.16(VCC) D7.16(VCC) D8.16(VCC) D9.16(VCC) D10.14(VCC) D11.14(VCC) D12.14(VCC) D13.5(VCC) D14.16(VCC) D15.16(VCC) D16.16(VCC) D17.16(VCC) D18.16(VCC) D19.14(VCC) D20.14(VCC) D21.14(VCC) D22.8(VCC) D23.8(VCC) D24.8(VCC) D25.8(VCC) D26.8(VCC) D27.8(VCC) D28.8(VCC) D29.8(VCC) D30.16(VCC) D31.16(VCC) D32.16(VCC) D33.14(VCC) D34.16(VCC) D35.24(VCC) D36.16(VCC) D37.16(VCC) D38.14(VCC) D39.14(VCC) D40.24(VCC) D41.16(VCC) D42.16(VCC) D43.16(VCC) D44.16(VCC) D45.14(VCC) D46.14(VCC) D47.16(VCC) D48.8(U+)
GND: C3.2 C4.1 C5.1 C6.1 C7.2 C8.1 C9.2 C10.1 C11.1 C12.1 C13.1 C14.1 C15.1 C16.1 C17.1 C18.1 C19.1 C20.2 C21.2 C22.2 C23.2 D1.7(GND) D2.7(GND) D3.7(GND) D4.10(GND) D5.8(GND) D6.8(GND) D7.8(GND) D8.8(GND) D9.8(GND) D10.7(GND) D11.7(GND) D12.7(GND) D13.12(GND) D14.8(GND) D15.8(GND) D16.8(GND) D17.8(GND) D18.8(GND) D19.7(GND) D20.7(GND) D21.7(GND) D22.16(GND) D23.16(GND) D24.16(GND) D25.16(GND) D26.16(GND) D27.16(GND) D28.16(GND) D29.16(GND) D30.8(GND) D31.8(GND) D32.8(GND) D33.7(GND) D34.8(GND) D35.12(GND) D36.8(GND) D37.8(GND) D38.7(GND) D39.7(GND) D40.12(GND) D41.8(GND) D42.8(GND) D43.8(GND) D44.8(GND) D45.7(GND) D46.7(GND) D47.8(GND) D48.1(U-)

### Notes on the sheet
- C3-C19: 0,022-0,1 мкф
- C20-C23*: Танталовый 47-100 мкф
- Перв. примен.
- Справ. №
- Подп. и дата
- Инв. № дубл.
- Взам. инв. №
- Разраб.
- Изм.
- Лист
- № докум.
- Подп.
- Дата
- Лит.
- Масса
- Масштаб
- Пров.
- Т.контр.
- Листов
- Инв. № подл.
- Утв.
- Н.контр.
- 2.106-A4
- Копировал
- Формат А4

### Library data of the parts
C3-C19 = К10-17: Value: 0,1 мкф
C20-C23 = К53-1: К53-14; Value: 47 мкф
D2 D19 D21 = К555ЛЕ1: ManufacturerPartNumber: К555ЛА3
D3 = К555ЛН1: ManufacturerPartNumber: К155ЛН1
D5-D8 = К555ИЕ10: ManufacturerPartNumber: КР531ИЕ17
D9 D32 D36 D37 D44 = К555ИР11А: ManufacturerPartNumber: КР531ИЕ17
D10 = К555ИР16: ManufacturerPartNumber: КР531ИЕ17
D12 = К555ЛП5: ManufacturerPartNumber: К155ЛП5
D13 = К155ИМ3: ManufacturerPartNumber: SN74ALS138
D15-D18 D41 D42 = К555КП12: ManufacturerPartNumber: К155КП2
D20 D39 = К555ЛИ3: ManufacturerPartNumber: К555ЛА3
D30 D31 = К555ТМ9: ManufacturerPartNumber: SN74ALS174
D43 = К555ИД7: ManufacturerPartNumber: SN74ALS138
D48 = КР1006ВИ1: ManufacturerPartNumber: К555ИД4
D1 D38 = К555ЛИ1: ManufacturerPartNumber: К555ЛИ1
D11 = К555ЛА3: ManufacturerPartNumber: К555ЛА3
D14 D47 = К555КП11: ManufacturerPartNumber: К555КП11
D22-D29 = К565РУ5: ManufacturerPartNumber: К565РУ5
D34 = К555ИД4: ManufacturerPartNumber: К555ИД4

## Nets that join several sheets
E1: Cell_121_sheet_1 (14 pins), Cell_121_sheet_2 (11 pins), Cell_121_sheet_3 (26 pins), Cell_121_sheet_4 (69 pins)
GND: Cell_121_sheet_1 (19 pins), Cell_121_sheet_2 (17 pins), Cell_121_sheet_3 (12 pins), Cell_121_sheet_4 (69 pins)
A0: Cell_121_sheet_1 (X1.B3), Cell_121_sheet_2 (D9.3 D16.3), Cell_121_sheet_3 (D45.2 D45.12 D46.2 D46.12)
A1: Cell_121_sheet_1 (X1.B4), Cell_121_sheet_2 (D9.4 D17.13), Cell_121_sheet_3 (D43.1)
A2: Cell_121_sheet_1 (X1.B5), Cell_121_sheet_2 (D15.13), Cell_121_sheet_3 (D43.2)
A3: Cell_121_sheet_1 (X1.B6), Cell_121_sheet_2 (D17.3), Cell_121_sheet_3 (D43.3)
A4: Cell_121_sheet_1 (X1.B7), Cell_121_sheet_2 (D15.11)
A5: Cell_121_sheet_1 (X1.B8), Cell_121_sheet_2 (D16.5)
A6: Cell_121_sheet_1 (X1.B9), Cell_121_sheet_2 (D17.11)
A7: Cell_121_sheet_1 (X1.B10), Cell_121_sheet_2 (D15.3)
A8: Cell_121_sheet_1 (X1.B11), Cell_121_sheet_2 (D16.13)
A9: Cell_121_sheet_1 (X1.B12), Cell_121_sheet_2 (D17.5)
A10: Cell_121_sheet_1 (X1.B13), Cell_121_sheet_2 (D15.5)
A11: Cell_121_sheet_1 (X1.B14), Cell_121_sheet_2 (D16.11)
A12: Cell_121_sheet_1 (X1.B15), Cell_121_sheet_2 (D18.3)
A13: Cell_121_sheet_1 (X1.B16), Cell_121_sheet_2 (D18.5)
A14: Cell_121_sheet_1 (X1.B17), Cell_121_sheet_2 (D18.11)
A15: Cell_121_sheet_1 (X1.B18), Cell_121_sheet_2 (D2.5)
D0: Cell_121_sheet_1 (D4.2 X1.A3), Cell_121_sheet_2 (D22.2)
D1: Cell_121_sheet_1 (D4.5 X1.A4), Cell_121_sheet_2 (D23.2)
D2: Cell_121_sheet_1 (D4.6 X1.A5), Cell_121_sheet_2 (D24.2)
D3: Cell_121_sheet_1 (D4.9 X1.A6), Cell_121_sheet_2 (D25.2)
D4: Cell_121_sheet_1 (D4.12 X1.A7), Cell_121_sheet_2 (D26.2)
D5: Cell_121_sheet_1 (D4.15 X1.A8), Cell_121_sheet_2 (D27.2)
D6: Cell_121_sheet_1 (D4.16 X1.A9), Cell_121_sheet_2 (D28.2)
D7: Cell_121_sheet_1 (D4.19 X1.A10), Cell_121_sheet_2 (D29.2)
NetD1_3: Cell_121_sheet_1 (D1.3 D2.9 D11.2), Cell_121_sheet_2 (D2.2)
NetD1_4: Cell_121_sheet_1 (D1.4 D11.5 D12.3), Cell_121_sheet_2 (D15.14 D16.14 D17.14 D18.14)
NetD1_6: Cell_121_sheet_1 (D1.6 D3.13), Cell_121_sheet_3 (6 pins)
NetD1_13: Cell_121_sheet_1 (D1.13 D8.12 D13.7 D13.16), Cell_121_sheet_3 (D20.13)
NetD2_3: Cell_121_sheet_1 (X1.A11), Cell_121_sheet_2 (D2.3)
NetD2_4: Cell_121_sheet_1 (D3.11 D11.1 X1.A19), Cell_121_sheet_2 (D2.4)
NetD2_11: Cell_121_sheet_1 (D2.11 D10.2 D10.4 D10.12), Cell_121_sheet_2 (D15.2 D16.2 D17.2 D18.2)
NetD2_12: Cell_121_sheet_1 (D2.12 D10.11 D12.12), Cell_121_sheet_2 (8 pins)
NetD3_2: Cell_121_sheet_1 (D3.2 D10.6), Cell_121_sheet_3 (D43.5)
NetD5_12: Cell_121_sheet_1 (D5.12 D11.9 D11.10), Cell_121_sheet_2 (D15.12)
NetD5_13: Cell_121_sheet_1 (D5.13), Cell_121_sheet_2 (D17.12)
NetD5_14: Cell_121_sheet_1 (D5.14), Cell_121_sheet_2 (D16.4)
NetD6_6: Cell_121_sheet_1 (D6.6 D6.11 D14.3), Cell_121_sheet_3 (D35.8)
NetD7_11: Cell_121_sheet_1 (D7.11), Cell_121_sheet_2 (D16.12)
NetD7_12: Cell_121_sheet_1 (D7.12 D19.3), Cell_121_sheet_2 (D15.4)
NetD7_13: Cell_121_sheet_1 (D7.13 D14.13 D19.2), Cell_121_sheet_3 (D35.6 D47.6)
NetD7_14: Cell_121_sheet_1 (D7.14 D14.6), Cell_121_sheet_3 (D35.7)
NetD8_14: Cell_121_sheet_1 (D8.14 D19.5), Cell_121_sheet_2 (D17.6), Cell_121_sheet_3 (D20.2)
NetD10_13: Cell_121_sheet_1 (D10.13), Cell_121_sheet_2 (8 pins), Cell_121_sheet_3 (D30.9 D31.9)
NetD11_6: Cell_121_sheet_1 (D11.6), Cell_121_sheet_2 (8 pins)
NetD12_6: Cell_121_sheet_1 (D12.6), Cell_121_sheet_3 (7 pins)
NetD13_2: Cell_121_sheet_1 (D13.2), Cell_121_sheet_2 (D16.6)
NetD13_6: Cell_121_sheet_1 (D13.6), Cell_121_sheet_2 (D15.10)
NetD13_9: Cell_121_sheet_1 (D13.9), Cell_121_sheet_2 (D17.4)
NetD13_15: Cell_121_sheet_1 (D13.15), Cell_121_sheet_2 (D17.10)
NetD14_1: Cell_121_sheet_1 (D14.1), Cell_121_sheet_3 (D38.10 D38.11)
NetD14_2: Cell_121_sheet_1 (D14.2 D14.10), Cell_121_sheet_3 (D46.6)
NetD14_4: Cell_121_sheet_1 (D14.4), Cell_121_sheet_2 (D15.6)
NetD14_5: Cell_121_sheet_1 (D14.5), Cell_121_sheet_3 (D38.9 D46.5)
NetD14_7: Cell_121_sheet_1 (D14.7), Cell_121_sheet_2 (D16.10)
NetD14_9: Cell_121_sheet_1 (D14.9), Cell_121_sheet_2 (D18.6)
NetD14_12: Cell_121_sheet_1 (D14.12), Cell_121_sheet_2 (D18.4)
NetD18_10: Cell_121_sheet_2 (D18.10), Cell_121_sheet_3 (D38.8)
NetD19_13: Cell_121_sheet_1 (D19.13), Cell_121_sheet_3 (D32.4)
NetD20_6: Cell_121_sheet_1 (D20.6), Cell_121_sheet_3 (R25.1 X2.5)
NetD20_8: Cell_121_sheet_1 (D20.8), Cell_121_sheet_3 (R26.1 X2.4)
NetD43_4: Cell_121_sheet_1 (X1.A26), Cell_121_sheet_3 (D43.4)
NetR24_1: Cell_121_sheet_1 (X1.B27), Cell_121_sheet_3 (R24.1)
RD0: Cell_121_sheet_1 (D4.3), Cell_121_sheet_2 (D22.14), Cell_121_sheet_3 (D30.3)
RD1: Cell_121_sheet_1 (D4.4), Cell_121_sheet_2 (D23.14), Cell_121_sheet_3 (D30.4)
RD2: Cell_121_sheet_1 (D4.7), Cell_121_sheet_2 (D24.14), Cell_121_sheet_3 (D30.6)
RD3: Cell_121_sheet_1 (D4.8), Cell_121_sheet_2 (D25.14), Cell_121_sheet_3 (D30.11)
RD4: Cell_121_sheet_1 (D4.13), Cell_121_sheet_2 (D26.14), Cell_121_sheet_3 (D30.13)
RD5: Cell_121_sheet_1 (D4.14), Cell_121_sheet_2 (D27.14), Cell_121_sheet_3 (D30.14)
RD6: Cell_121_sheet_1 (D4.17), Cell_121_sheet_2 (D28.14), Cell_121_sheet_3 (D31.3)
RD7: Cell_121_sheet_1 (D4.18), Cell_121_sheet_2 (D29.14), Cell_121_sheet_3 (D31.4)